# Altium project tester-supla-main.PrjPCB
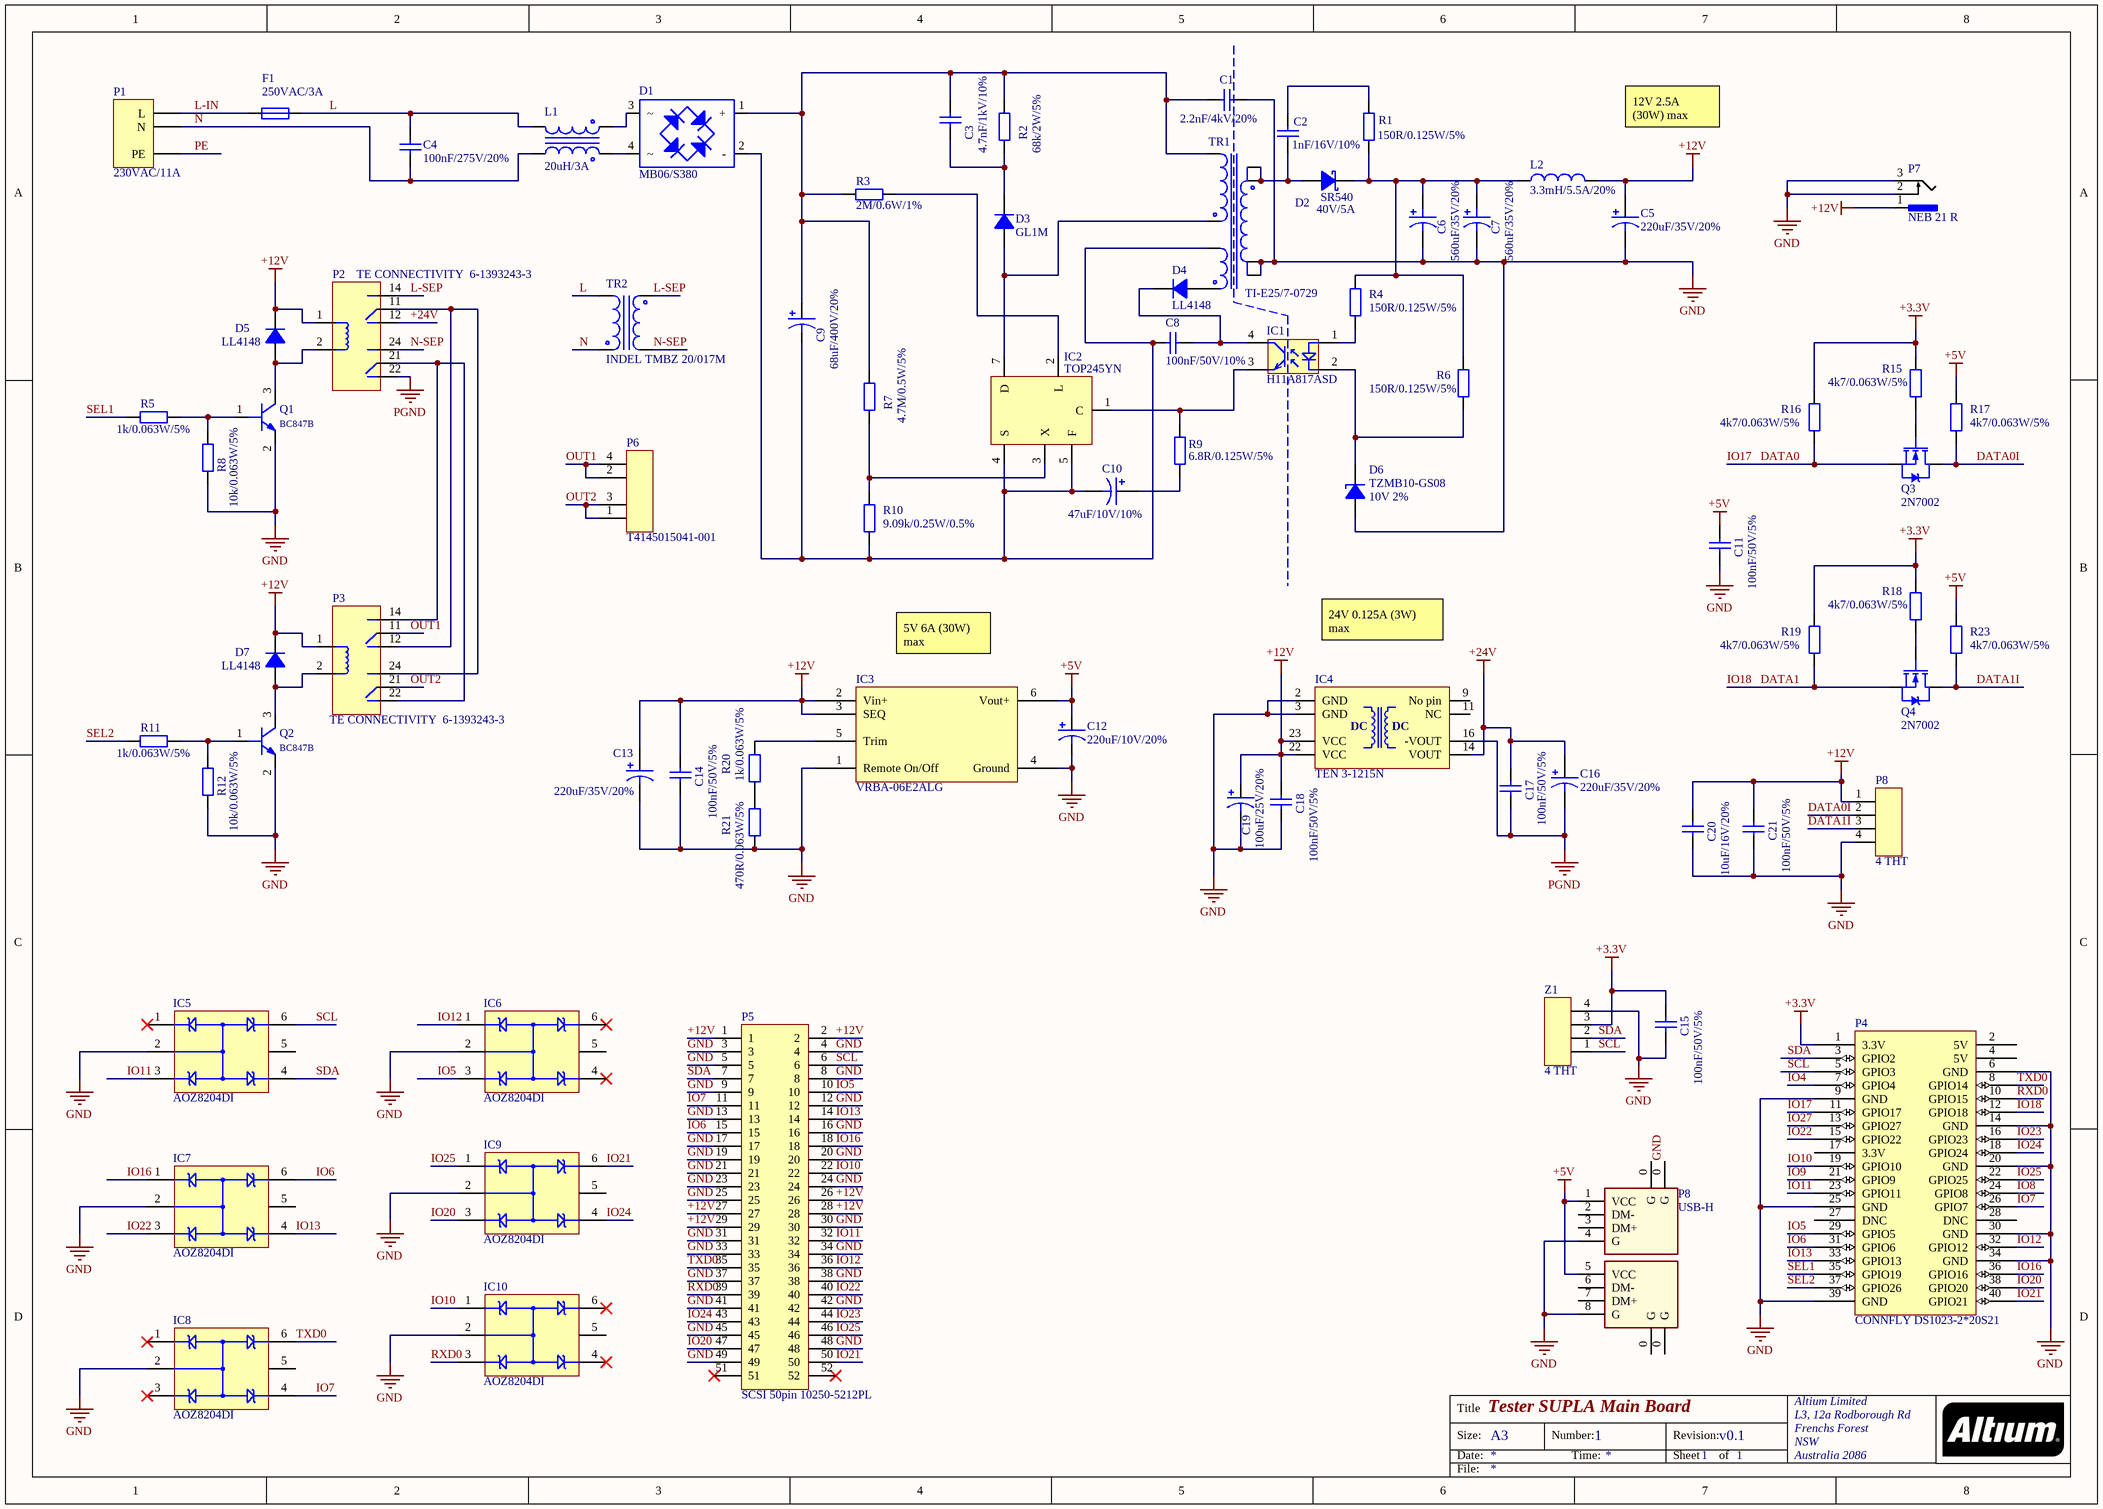
[diagram p0: tester-supla-main.SchDoc]
1 sheet, 77 parts. Net scope: global (net labels, ports and power ports of the same name join across sheets).
Board file: tester-supla-main.PcbDoc

## Sheet tester-supla-main.SchDoc: Tester SUPLA Main Board
size A3; DrawnBy: Marcin Świerczek; Engineer: Marcin Świerczek; Organization: Altium Limited; Address1: L3, 12a Rodborough Rd; Address2: Frenchs Forest; Address3: NSW; Address4: Australia 2086; DocumentNumber: 1; Revision: v0.1; SheetNumber: 1; SheetTotal: 1

### Parts
(Parts that share a designator on the sheet are numbered #1, #2 ... from top to bottom, then left to right.)
C1  2.2nF/4kV/20%  [Y1-10mm]
C2  1nF/16V/10%  [0603_C]
C3  4.7nF/1kV/10%  [1206_C]
C4  100nF/275V/20%  [MKP 18 x 6 x 14]
C5  220uF/35V/20%  [8x16x3.5]
C6  560uF/35V/20%  [10x25x5]
C7  560uF/35V/20%  [10x25x5]
C8  100nF/50V/10%  [1206_C]
C9  68uF/400V/20%  [18x25x7.5]
C10  47uF/10V/10%  [5x11x2]
C11  100nF/50V/5%  [0603_C]
C12  220uF/10V/20%  [6.3x11x2.5-LESR]
C13  220uF/35V/20%  [8x16x3.5]
C14  100nF/50V/5%  [0603_C]
C15  100nF/50V/5%  [0603_C]
C16  220uF/35V/20%  [8x16x3.5]
C17  100nF/50V/5%  [0603_C]
C18  100nF/50V/5%  [0603_C]
C19  100uF/25V/20%  [6.3x11x2.5]
C20  10uF/16V/20%  [0603_C]
C21  100nF/50V/5%  [0603_C]
D1  MB06/S380  [DIL-04]
D2  SR540  value 40V/5A  [DO-201AD]
D3  GL1M  [miniMELF]
D4  LL4148  [miniMELF]
D5  LL4148  [miniMELF]
D6  TZMB10-GS08  value 10V 2%  [miniMELF]
D7  LL4148  [miniMELF]
F1  250VAC/3A  [SCHURTER 3101.0050]
IC1  H11A817ASD  [LTV-357T]
IC2  TOP245YN  [TO-220-7C]
IC3  VRBA-06E2ALG  [VRBA-06E2ALG]
IC4  TEN 3-1215N  [TEN3N]
IC5  AOZ8204DI  [DFN-6 -NOTHERMAL]
IC6  AOZ8204DI  [DFN-6 -NOTHERMAL]
IC7  AOZ8204DI  [DFN-6 -NOTHERMAL]
IC8  AOZ8204DI  [DFN-6 -NOTHERMAL]
IC9  AOZ8204DI  [DFN-6 -NOTHERMAL]
IC10  AOZ8204DI  [DFN-6 -NOTHERMAL]
L1  20uH/3A  [PLT09HN2003R0P1B]
L2  3.3mH/5.5A/20%  [COIL_5X6.5]
P1  230VAC/11A  [DC21.0021.1111]
P2  TE CONNECTIVITY  6-1393243-3  [7-1393243-9]
P3  TE CONNECTIVITY  6-1393243-3  [7-1393243-9]
P4  CONNFLY DS1023-2*20S21  [RPI-3B+]
P5  SCSI 50pin 10250-5212PL  [10250-5212PL]
P6  T4145015041-001  [T4145015041-001]
P7  NEB 21 R  [NEB 21 R]
P8#1  4 THT  [4 THT]  (no BOM)
P8#2  USB-H  [GN USBA_2G]
Q1  BC847B  [SOT23_R]
Q2  BC847B  [SOT23_R]
Q3  2N7002  [SOT23_R]
Q4  2N7002  [SOT23_R]
R1  150R/0.125W/5%  [0805_R]
R2  68k/2W/5%  [RES3.2X9R]
R3  2M/0.6W/1%  [RES3.2X9R]
R4  150R/0.125W/5%  [0805_R]
R5  1k/0.063W/5%  [0402_R]
R6  150R/0.125W/5%  [0805_R]
R7  4.7M/0.5W/5%  [RES3.2X9R]
R8  10k/0.063W/5%  [0402_R]
R9  6.8R/0.125W/5%  [0805_R]
R10  9.09k/0.25W/0.5%  [1206_R]
R11  1k/0.063W/5%  [0402_R]
R12  10k/0.063W/5%  [0402_R]
R15  4k7/0.063W/5%  [0402_R]
R16  4k7/0.063W/5%  [0402_R]
R17  4k7/0.063W/5%  [0402_R]
R18  4k7/0.063W/5%  [0402_R]
R19  4k7/0.063W/5%  [0402_R]
R20  1k/0.063W/5%  [0402_R]
R21  470R/0.063W/5%  [0402_R]
R23  4k7/0.063W/5%  [0402_R]
TR1  TI-E25/7-0729  [TI-E25/7-0729]
TR2  INDEL TMBZ 20/017M  [TMBZ 20/017M]
Z1  4 THT  [4 THT]  (no BOM)

### Nets
+3.3V: C15.2 P4.1(3.3V) R15.2 R16.2 R18.2 R19.2 Z1.3
+5V: C11.2 C12.1 IC3.6(Vout+) P8#2.1(VCC) P8#2.5(VCC) R17.2 R23.2
+12V: C5.1 C13.1 C14.2 C18.2 C19.1 C20.2 C21.2 D5.1(K) D7.1(K) IC3.2(Vin+) IC3.3(SEQ) IC4.22(VCC) IC4.23(VCC) L2.2 P2.1(COIL1) P3.1(COIL1) P5.1 P5.2 P5.26 P5.27 P5.28 P5.29 P7.1 P8#1.1
+24V: C16.1 C17.2 IC4.14(VOUT) P2.12(NO1)
GND: C1.1 C5.2 C6.2 C7.2 C11.1 C12.2 C13.2 C14.1 C15.1 C18.1 C19.2 C20.1 C21.1 D6.2(A) IC3.1(Remote_On/Off) IC3.4(Ground) IC4.2(GND) IC4.3(GND) IC5.2 IC6.2 IC7.2 IC8.2 IC9.2 IC10.2 P4.6(GND) P4.9(GND) P4.14(GND) P4.20(GND) P4.25(GND) P4.30(GND) P4.34(GND) P4.39(GND) P5.3 P5.4 P5.5 P5.8 P5.9 P5.12 P5.13 P5.16 P5.17 P5.19 P5.20 P5.21 P5.23 P5.24 P5.25 P5.30 P5.31 P5.33 P5.34 P5.37 P5.38 P5.41 P5.42 P5.45 P5.48 P5.49 P7.2 P7.3 P8#1.4 P8#2.0(G) P8#2.4(G) P8#2.8(G) Q1.2(EMITTER) Q2.2(EMITTER) R8.1 R12.1 R21.1 TR1.6 TR1.7 Z1.4
PGND: C16.2 C17.1 IC4.16(-VOUT) P2.22(NO1)
DATA0: P4.11(GPIO17) Q3.3(S) R16.1  [also labelled IO17]
DATA0I: P8#1.2 Q3.2(D) R17.1
DATA1: P4.12(GPIO18) Q4.3(S) R19.1  [also labelled IO18]
DATA1I: P8#1.3 Q4.2(D) R23.1
IO4: P4.7(GPIO4)
IO5: IC6.3 P4.29(GPIO5) P5.10
IO6: IC7.6 P4.31(GPIO6) P5.15
IO7: IC8.4 P4.26(GPIO7) P5.11
IO8: P4.24(GPIO8)
IO9: P4.21(GPIO9)
IO10: IC10.1 P4.19(GPIO10) P5.22
IO11: IC5.3 P4.23(GPIO11) P5.32
IO12: IC6.1 P4.32(GPIO12) P5.36
IO13: IC7.4 P4.33(GPIO13) P5.14
IO16: IC7.1 P4.36(GPIO16) P5.18
IO20: IC9.3 P4.38(GPIO20) P5.47
IO21: IC9.6 P4.40(GPIO21) P5.50
IO22: IC7.3 P4.15(GPIO22) P5.40
IO23: P4.16(GPIO23) P5.44
IO24: IC9.4 P4.18(GPIO24) P5.43
IO25: IC9.1 P4.22(GPIO25) P5.46
IO27: P4.13(GPIO27)
L: C4.2 F1.1 L1.3 TR2.1
L-IN: F1.2 P1.1(L)
L-SEP: P2.14(NO2) TR2.4
N: C4.1 L1.2 P1.2(N) TR2.2
N-SEP: P2.24(NO2) TR2.3
OUT1: P3.11(NO1) P6.2 P6.4
OUT2: P3.21(NO1) P6.1 P6.3
PE: P1.3(PE)
RXD0: IC10.3 P4.10(GPIO15) P5.39
SCL: IC5.6 P4.5(GPIO3) P5.6 Z1.1
SDA: IC5.4 P4.3(GPIO2) P5.7 Z1.2
SEL1: P4.35(GPIO19) R5.1
SEL2: P4.37(GPIO26) R11.1
TXD0: IC8.6 P4.8(GPIO14) P5.35
NetC1_2: C1.2 C3.2 C9.1 D1.1(+) R2.2 R3.1 R7.2 TR1.1
NetC2_1: C2.1 R1.1
NetC2_2: C2.2 D2.2(A) TR1.9 TR1.10
NetC3_1: C3.1 D3.1(K) R2.1
NetC6_1: C6.1 C7.1 D2.1(K) L2.1 R1.2 R4.2 R6.2
NetC8_1: C8.1 D4.1(K) IC1.4
NetC8_2: C8.2 C9.2 C10.2 D1.2(-) IC2.4(S) IC2.5(F) R10.1 TR1.4
NetC10_1: C10.1 R9.1
NetD1_3: D1.3 L1.4
NetD1_4: D1.4 L1.1
NetD3_2: D3.2(A) IC2.7(D) TR1.3
NetD4_2: D4.2(A) TR1.5
NetD5_2: D5.2(A) P2.2(COIL2) Q1.3(COLLECTOR)
NetD6_1: D6.1(K) IC1.2 R6.1
NetD7_2: D7.2(A) P3.2(COIL2) Q2.3(COLLECTOR)
NetIC1_1: IC1.1 R4.1
NetIC1_3: IC1.3 IC2.1(C) R9.2
NetIC2_2: IC2.2(L) R3.2
NetIC2_3: IC2.3(X) R7.1 R10.2
NetIC3_5: IC3.5(Trim) R20.2
NetP2_11: P2.11(NO1) P3.12(NO1) P3.24(NO2)
NetP2_21: P2.21(NO1) P3.14(NO2) P3.22(NO1)
NetQ1_1: Q1.1(BASE) R5.2 R8.2
NetQ2_1: Q2.1(BASE) R11.2 R12.2
NetQ3_1: Q3.1(G) R15.1
NetQ4_1: Q4.1(G) R18.1
NetR20_1: R20.1 R21.2

Not connected (* = marked no-connect by the designer): IC4 9(No_pin) 11(NC); IC5 1* 5; IC6 4* 5 6*; IC7 5; IC8 1* 3* 5; IC9 5; IC10 4* 5 6*; P4 2(5V) 4(5V) 17(3.3V) 27(DNC) 28(DNC); P5 51* 52*; P8#2 2(DM-) 3(DM+) 6(DM-) 7(DM+)

### Notes on the sheet
- 12V 2.5A (30W) max
- (near IC3) 5V 6A (30W) max
- 24V 0.125A (3W) max
- Title
- Size:
- Date:
- A3
- Number:
- Time:
- Revision:
- Sheet
- of
- File:
- (in symbol TEN3-1215N) DC

### Library data of the parts
C1 = 2.2nF/4kV/20%: Kondensator: ceramiczny; Y1; 2,2nF; 400VAC; Y5V; ±20%; THT; 10mm; 4kV; PartNumber: _EC1800026; Link: *; Technology: THT; Price: *; Value: 2.2nF/4kV/20%
C2 = 1nF/50V/10%: kondensator ceramiczny 1 nF 50 V X7R 10% 0603; PartNumber: _EC1500100; Link: *; Technology: SMT; Price: *; Value: 1nF/16V/10%
C3 = 4.7nF/1kV/10%: kondensator ceramiczny 4.7nF 1 kV X7R 10% 1206; PartNumber: _EC...; Link: https://www.tme.eu/pl/details/1206ac472kat1a/kondensatory-mlcc-smd-1206/avx/; Technology: SMT; Price: *; Value: 4.7nF/1kV/10%
C4 = 100nF/275V/20%: kondensator 100 nF MKP X2 20% 275 V 6x18x14 mm, R=15; PartNumber: _EC2000119; Link: *; Technology: THT; Price: *; Value: 100nF/275V/20%
C5 C13 C16 = 220uF/35V/20%: Kondensator: elektrolityczny; niskoimpedancyjny; THT; 220uF; ±20%; PartNumber: _EC...; Link: https://www.tme.eu/pl/details/ed1v221mnn0816/kondensatory-elektr-tht-niskoimpedan/elite/; Technology: THT; Price: *; Value: 220uF/35V/20%
C6 C7 = 560uF/35V/20%: Kondensator: elektrolityczny; niskoimpedancyjny; THT; 560uF; ±20%; PartNumber: _EC...; Link: https://www.tme.eu/pl/details/upw1v561mpd/kondensatory-elektr-tht-niskoimpedan/nichicon/; Technology: THT; Price: *; Value: 560uF/35V/20%
C8 = 100nF/50V/10%: Kondensator ceramiczny 100 nF 50V X7R 10% 1206 nie Samsung [5000-116]; PartNumber: _EC1700006; Link: *; Technology: SMT; Price: *; Value: 100nF/50V/10%
C9 = 68uF/400V/20%: Kondensator elektrolityczny Elite KJ2G680MNN1825 68uF 400V 20% 18x25x7.5; PartNumber: _EC....; Link: https://www.tme.eu/pl/details/kj2g680mnn1825/kondensatory-elektrolityczne-tht-105degc/elite/; Technology: THT; Price: *; Value: 68uF/400V/20%
C10 = 47uF/10V/10%: Kondensator elektrolityczny 47uF 10V 10% 5X11; PartNumber: _EC2000012; Technology: SMT; Price: *; Value: 47uF/10V/10%
C11 C14 C15 C17 C18 C21 = 100nF/50V/5%: kondensator ceramiczny 100 nF MLCC 50 V X7R 5% 0603; PartNumber: _EC1500097; Link: *; Technology: SMT; Price: *; Value: 100nF/50V/5%
C12 = 220uF/10V/20%: Kondensator elektrolityczny 220uF LowESR 10V 20% 6.3x11x2.5; PartNumber: _EC2000094; Link: *; Technology: THT; Price: *; Value: 220uF/10V/20%
C19 = 100uF/25V/20%: Kondensator elektrolityczny 100 uF 25V 20% 6.3x11x2.5; PartNumber: _EC2000097; Link: *; Technology: THT; Price: *; Value: 100uF/25V/20%
C20 = 10uF/16V/20%: kondensator ceramiczny 10 uF 16 V X5R 20% 0603; PartNumber: _EC1500099; Link: *; Technology: SMT; Price: *; Value: 10uF/16V/20%
D1 = MB06/S380: Mostek prostowniczy MB06/S380 DIL-04; PartNumber: _EC4200003; Link: *; Price: *; Technology: SMT; Value: MB06/S380
D2 = SR540: dioda prostownicza Schottky SR540 40 V, 5 A (TME SR540); PartNumber: _EC3900019; Price: *; Technology: SMT
D3 = GL1M: dioda prostownicza 1 A, 600 V 50-75 ns SMD DO-213AA; PartNumber: _EC3900008; Link: *; Price: *; Technology: SMT; Value: GL1M
D4 D5 D7 = LL4148: dioda impulsowa LL4148 minimelf; PartNumber: _EC3800001; Link: *; Price: *; Technology: SMT; Value: LL4148
D6 = TZMB10-GS08: Dioda: Zenera; 0,5W; 10V; SMD; rolka,taśma; MiniMELF; PartNumber: _EC...; Link: *; Price: *; Technology: SMT
F1 = SCHURTER 3101.0050: Gniazdo; bezpieczniki rurkowe; Montaż: THT; 5x20mm; -40÷85°C; 10A; PartNumber: _EC...; Link: *; Technology: THT; Value: 250VAC/3A; Price: *
IC1 = H11A817ASD: Transoptor H11A817ASD (FOD817ASD) Fairchild SMD; PartNumber: _EC4500002; Technology: SMT
IC2 = TOP245YN: TOP245YN PMIC; AC/DC switcher,kontroler SMPS; 61,5-140kHz; TO220-7C; 60W; PartNumber: _EC...; Link: https://www.tme.eu/pl/details/top245yn/regulatory-napiecia-uklady-pwm/power-integrations/; Value: TOP245YN; Technology: THT
IC3 = VRBA-06E2ALG: Non-isolated DC/DC converter
IC4 = TEN3-1215N: Przetwornik: DC/DC; 3W; Uwej: 9÷18V; 24VDC; Iwyj: 125mA; DIP24; 12,8g; PartNumber: _EC...; Technology: THT; Link: https://www.tme.eu/pl/details/ten3-1215n/przetworniki-dc-dc/traco-power/ten-3-1215n/
IC5-IC10 = AOZ8204DI: układ scalony AOZ8204DI; PartNumber: _EC4900210; ComponentLink1Description: Manufacturer URL; ComponentLink1URL: http://www.microchip.com; ComponentLink2Description: Datasheet; ComponentLink2URL: http://ww1.microchip.com/downloads/en/DeviceDoc/25004B.pdf; ComponentLink3Description: Package Specification; ComponentLink3URL: http://www.microchip.com/stellent/groups/techpub_sg/documents/packagingspec/en012702.pdf; ComponentLink4Description: Product URL; ComponentLink4URL: http://www.microchip.com/MCP16301; Price: *; Technology: SMT; Value: *
L1 = MURATA PLT09HN2003R0P1B: Dławik: drutowy; THT; 20uH; 3A; 100Ω; -40÷85°C; pionowy; 14x13x8mm; PartNumber: _EC...; Technology: THT; Value: 20uH/3A; Price: *; Link: *
L2 = 3.3mH/5.5A/20%: Dławik: drutowy; THT; 3,3uH; Ipracy: 5,5A; 23,35mΩ; ±20%; pionowy; PartNumber: _EC...; Technology: THT; Value: 3.3mH/5.5A/20%; Price: *; Link: https://www.tme.eu/pl/details/coil0608-0.0033/dlawiki-pionowe/ferrocore/
P1 = SCHURTER DC21.0021.1111: Złącze: zasilające AC; gniazdo; męskie; 11A; IEC 60320; THT; 70°C; PartNumber: _EC...; Link: *; Technology: THT; Value: 230VAC/11A; Price: *
P2 P3 = TE 6-1393243-3: Przekaźnik TE CONNECTIVITY 6-1393243-3; Technology: SMT; Value: TE CONNECTIVITY  6-1393243-3; Price: *; Link: https://www.tme.eu/pl/details/rt424012/przekazniki-elektromagn-miniaturowe/te-connectivity/6-1393243-3/
P4 = RPI3B+ GPIO 40 PIN 2,54mm: Gniazdo; kołkowe; żeńskie; PIN: 40; proste; 2,54mm; THT; 2x20; 3A; PartNumber: _EC...; Value: 2x20 Pin 2.54mm; Link: https://www.tme.eu/pl/details/zl262-40dg/listwy-i-gniazda-kolkowe/connfly/ds1023-2-20s21/; Price: *; Technology: THT
P5 = SCSI 50pin 10250-5212PL: Złącze SCSI żeńskie 50-pinowe Kąt prosty przepust, raster 2.54mm seria 102 3M 10250-5212PL; PartNumber: _EC...; Technology: SMT; Link: https://pl.rs-online.com/web/p/zlacza-scsi/4999803/
P6 = T4145015041-001: TE ConnectivityT4145015041-001; PartNumber: _EC...; Technology: THT; Link: https://www.tme.eu/pl/details/t4145015041-001/wtyki-i-gniazda/te-connectivity/
P7 = NEB 21 R: Złącze przemysłowe - zasilające, 3A, 12 V DC, THT, Lumberg; PartNumber: EC_; Technology: THT; Value: NEB 21 R
P8#1 Z1 = 4 THT: 4 THT 4 x 2,54mm
P8#2 = GN USBx2  H: Gniazdo USB poziome; PartNumber: _EC...; Technology: THT
Q1 Q2 = BC847B: Tranzystor BC847B SOT-23; PartNumber: _EC4400001; Value: 45V/100mA; Technology: SMT
Q3 Q4 = 2N7002: Tr. unipolarny N-MOSFET; PartNumber: EC____; Value: 60V/300mV; Link: *; Technology: SMT; Price: *
R1 R4 R6 = 150R/0.125W/5%: Rezystor 150 R 5% 0805; PartNumber: _EC2700011; Link: *; Technology: SMT; Value: 150R/0.125W/5%; Price: *
R2 = 68k/2W/5%: Rezystor: węglowy; THT; 68kΩ; 2W; ±5%; Ø4,2x11mm; Wypr: osiowe; PartNumber: _EC...; Link: https://www.tme.eu/pl/details/cf2ws-68k/rezystory-weglowe-tht-2w/sr-passives/; Technology: THT; Value: 68k/2W/5%; Price: *
R3 = 2M/0.6W/1%: rezystor 2M 1% 3,2x9mm; PartNumber: _EC...; Link: https://www.tme.eu/pl/details/cf1_2w-4m7/rezystory-weglowe-tht-1-2w/sr-passives/cf1-2w-4m7/; Technology: THT; Value: 2M/0.6W/1%; Price: *
R5 R11 R20 = 1k/0.063W/5%: Rezystor 1 K 5% 0402; PartNumber: _EC2600083; Technology: SMT; Value: 1k/0.063W/5%; Price: *
R7 = 4.7M/0.5W/5%: rezystor 4.7M 5% 3,2x9mm; PartNumber: _EC...; Link: https://www.tme.eu/pl/details/cf1_2w-4m7/rezystory-weglowe-tht-1-2w/sr-passives/cf1-2w-4m7/; Technology: THT; Value: 4.7M/0.5W/5%; Price: *
R8 R12 = 10k/0.063W/5%: rezystor 10 K 5% 0402; PartNumber: _EC2600075; Link: *; Technology: SMT; Value: 10k/0.063W/5%; Price: *
R9 = 6.8R/0.125W/5%: rezystor 6.8R 5% 0805; PartNumber: _EC...; Link: *; Technology: SMT; Value: 6.8R/0.125W/5%; Price: *
R10 = 9.09k/0.25W/0.5%: Rezystor 9.09k 0.5% 1206; PartNumber: _EC...; Link: https://www.tme.eu/pl/details/arg1206-9k09-0.5%2525/rezystory-smd-1206/viking/arg06dtc9091/; Technology: SMT; Value: 9.09k/0.25W/0.5%; Price: *
R15-R19 R23 = 4k7/0.063W/5%: rezystor 4,7 k 5% 0402; PartNumber: _EC2600189; Link: *; Technology: SMT; Value: 4k7/0.063W/5%; Price: *
R21 = 470R/0.063W/5%: Rezystor 470 R 5% 0402; PartNumber: _EC2600082; Link: *; Technology: SMT; Value: 470R/0.063W/5%; Price: *
TR1 = TI-E25/7-0729: Trans. imp. TI-E25/7-0729 TOP245Y (Feryster); PartNumber: _EC...; Technology: THT; Value: TI-E25/7-0729; Price: *; Link: *
TR2 = INDEL TMBZ 20/017M: Transformator: zalewany; 20VA; 230VAC; 230V; 0,08A; Montaż: śrubowy; PartNumber: _EC...; Technology: THT; Value: INDEL TMBZ 20/017M; Price: *; Link: *